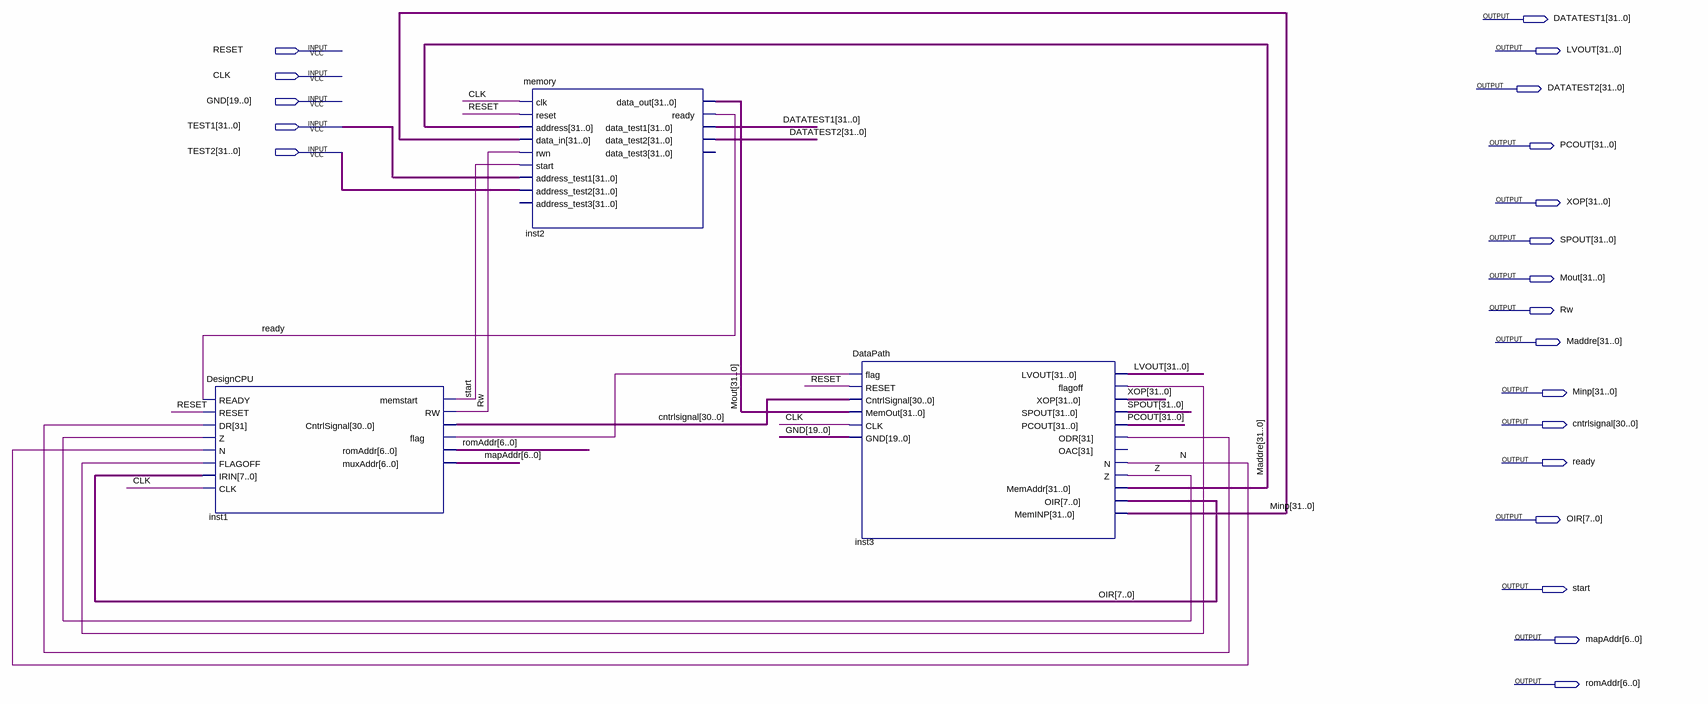
[diagram p0: schematic sheet]
// Quartus schematic TOT.bdf as structural Verilog: 3 symbols, 21 pins
module TOT (
  input  RESET,
  input  CLK,
  input  [19:0] GND,
  input  [31:0] TEST1,
  input  [31:0] TEST2,
  output [31:0] DATATEST1,
  output [31:0] LVOUT,
  output [31:0] DATATEST2,
  output [31:0] PCOUT,
  output [31:0] XOP,
  output [31:0] SPOUT,
  output [31:0] Mout,
  output Rw,
  output [31:0] Maddre,
  output [31:0] Minp,
  output [30:0] cntrlsignal,
  output ready,
  output [7:0] OIR,
  output start,
  output [6:0] mapAddr,
  output [6:0] romAddr
);

  wire inst1_flag, inst3_flagoff, inst3_odr, N, Z;

  DesignCPU inst1 (
    .READY(ready), .RESET(RESET), .DR(inst3_odr), .Z(Z), .N(N), .FLAGOFF(inst3_flagoff), .IRIN(OIR),
    .CLK(CLK), .memstart(start), .RW(Rw), .CntrlSignal(cntrlsignal), .flag(inst1_flag), .romAddr(romAddr),
    .muxAddr(mapAddr));
  memory inst2 (
    .clk(CLK), .reset(RESET), .address(Maddre), .data_in(Minp), .rwn(Rw), .start(start),
    .address_test1(TEST1), .address_test2(TEST2), .data_out(Mout), .ready(ready), .data_test1(DATATEST1),
    .data_test2(DATATEST2));  // open: address_test3, data_test3
  DataPath inst3 (
    .flag(inst1_flag), .RESET(RESET), .CntrlSignal(cntrlsignal), .MemOut(Mout), .CLK(CLK), .GND(GND),
    .LVOUT(LVOUT), .flagoff(inst3_flagoff), .XOP(XOP), .SPOUT(SPOUT), .PCOUT(PCOUT), .ODR(inst3_odr), .N(N),
    .Z(Z), .MemAddr(Maddre), .OIR(OIR), .MemINP(Minp));  // open: OAC
endmodule
